# Altium schematic sheet P1.schdoc
size 297 x 209 mm; Symbol: Drawing-Symbol_A4; Company: 嘉立创EDA; Version: V1.0; Page Size: A4; @Project Name: ADS1232; @Update Date: 2026-08-26; @Create Date: 2026-08-26; Device: Drawing-Symbol_A4; @Board Name: Board1; @Page Name: P1; @Create Time: 10:54:31; @Page Count: 1; @Page No: 1; @Schematic Name: Schematic1; @Update Time: 10:54:31; @Assembly Variant: Basic; Border: 1; Title Block Position: 3; Size: A4; Width: 1170; Height: 825; Region Start: 1; X Region Count: 6; Y Region Count: 4; Blade Width: 10; SheetNumber: 1; SheetTotal: 1
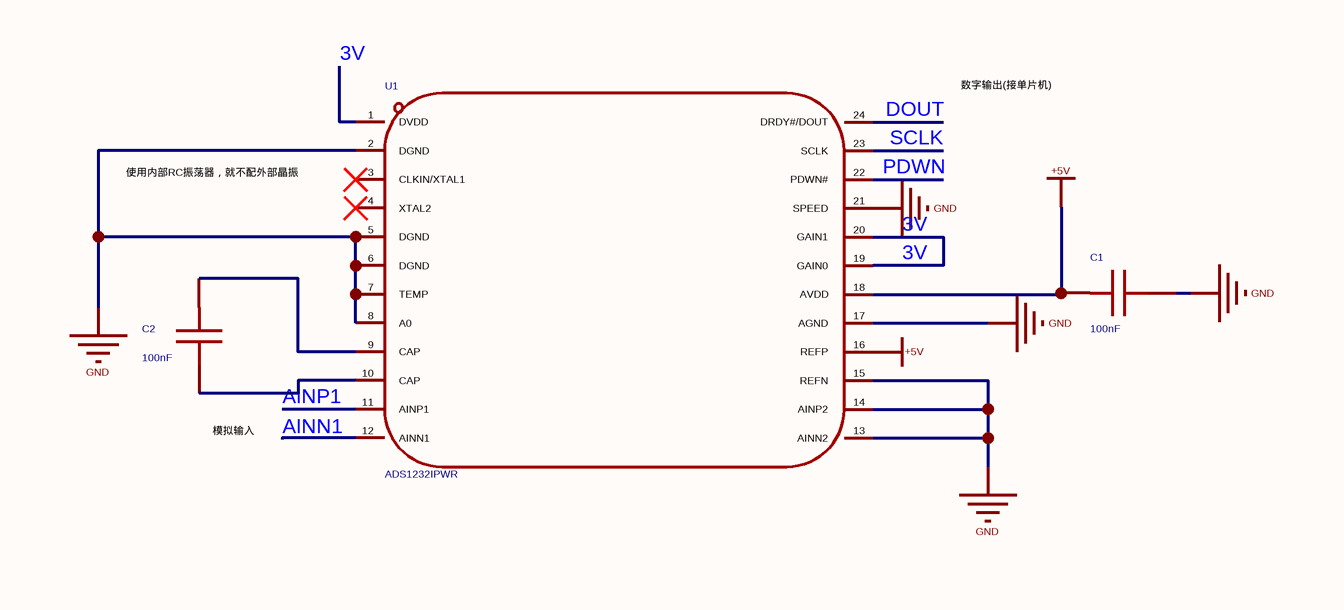
[diagram p0: P1.schdoc]

## Parts
C1  100nF  [C0603]
C2  100nF  [C0603]
U1  ADS1232IPWR  [TSSOP-24_L7.8-W4.4-P0.65-LS6.4-BL]

## Nets
+5V: C1.2 U1.16(REFP) U1.18(AVDD)
GND: C1.1 U1.2(DGND) U1.5(DGND) U1.6(DGND) U1.7(TEMP) U1.8(A0) U1.13(AINN2) U1.14(AINP2) U1.15(REFN) U1.17(AGND) U1.21(SPEED)
3V: U1.1(DVDD) U1.19(GAIN0) U1.20(GAIN1)
AINN1: U1.12(AINN1)
AINP1: U1.11(AINP1)
DOUT: U1.24(DRDY#/DOUT)
PDWN: U1.22(PDWN#)
SCLK: U1.23(SCLK)
NetC2_1: C2.1 U1.10(CAP)
NetC2_2: C2.2 U1.9(CAP)

Not connected (* = marked no-connect by the designer): U1 3(CLKIN/XTAL1)* 4(XTAL2)*

## Notes on the sheet
- 数字输出(接单片机)
- 使用内部RC振荡器，就不配外部晶振
- (near C2) 模拟输入
- 创建日期
- 2026-08-26
- 原理图
- 板子
- Schematic1
- Board1
- 更新日期
- 图页
- P1
- 绘制
- 审阅
- ADS1232
- 版本
- V1.0
- 尺寸
- A4
- 页    1    共    1
- 嘉立创EDA

## Library data of the parts
C1 C2 = CAP_0603: Symbol: Capacitance; ConvertToPcb: yes; ModelId: ac125912035d415993ca9572d50418b1聨0819f05c4eef4c71ace90d822a990e87; ModelName: C0603_L1.6-W0.8-H0.8; ModelTransform: 62.992,31.496,0,0,0,0,0,0,0; Device: CAP_0603; AddInBom: yes; Supplier Footprint: 0603; FootprintName: C0603; Value: 100nF
U1 = ADS1232IPWR: 分辨率(位):24;采样率:10Hz;工作电压:2.7V~5.3V;接口类型:SPI;; Manufacturer: TI(德州仪器); AddInBom: yes; ModelId: 57e278220af748a2882c4abba4094eb9聨0819f05c4eef4c71ace90d822a990e87; ModelName: TSSOP-24_L7.8-W4.4-H1.0-LS6.4-P0.65; ModelTransform: 252.188,307.086,0,90,0,0,0,0,0; Resolution (Bits): 24; Sampling Rate: 10Hz; number of channels: 2; Interface: SPI; differential input: 是; Clock/Oscillator: 内置；外置; Clock Frequency: 4.9152MHz；200kHz~8MHz; Voltage Reference: 外置; Programmable Gain: 支持; Temperature Sensors: 内置; ADC architecture: Sigma-Delta; Data rate: 80Hz；10Hz; Quiescent Current (Iq): 1.3uA; Full-Scale Range(FSR): 39mV；1.25V；19.5mV；2.5V; Symbol: ADS1232IPW; Device: ADS1232IPWR; LCSC Part Name: 用于桥式传感器的24bit 模数转换器; SupplierPart: C27919; ManufacturerPart: ADS1232IPWR; Supplier Footprint: TSSOP-24; JLCPCB Part Class: Extended Part; Datasheet: https://www.ti.com/cn/lit/gpn/ads1232; Supplier: LCSC; ConvertToPcb: yes; FootprintName: TSSOP-24_L7.8-W4.4-P0.65-LS6.4-BL; Voltage - Supply: 2.7V~5.3V; Integral non - linearity: -; Operating Temperature: -40℃~+105℃; Signal-to-Noise Ratio: -; Voltage Reference Drift: -